# Altium schematic sheet 1_Mcu.SchDoc: MCU
size A3; SheetNumber: 1
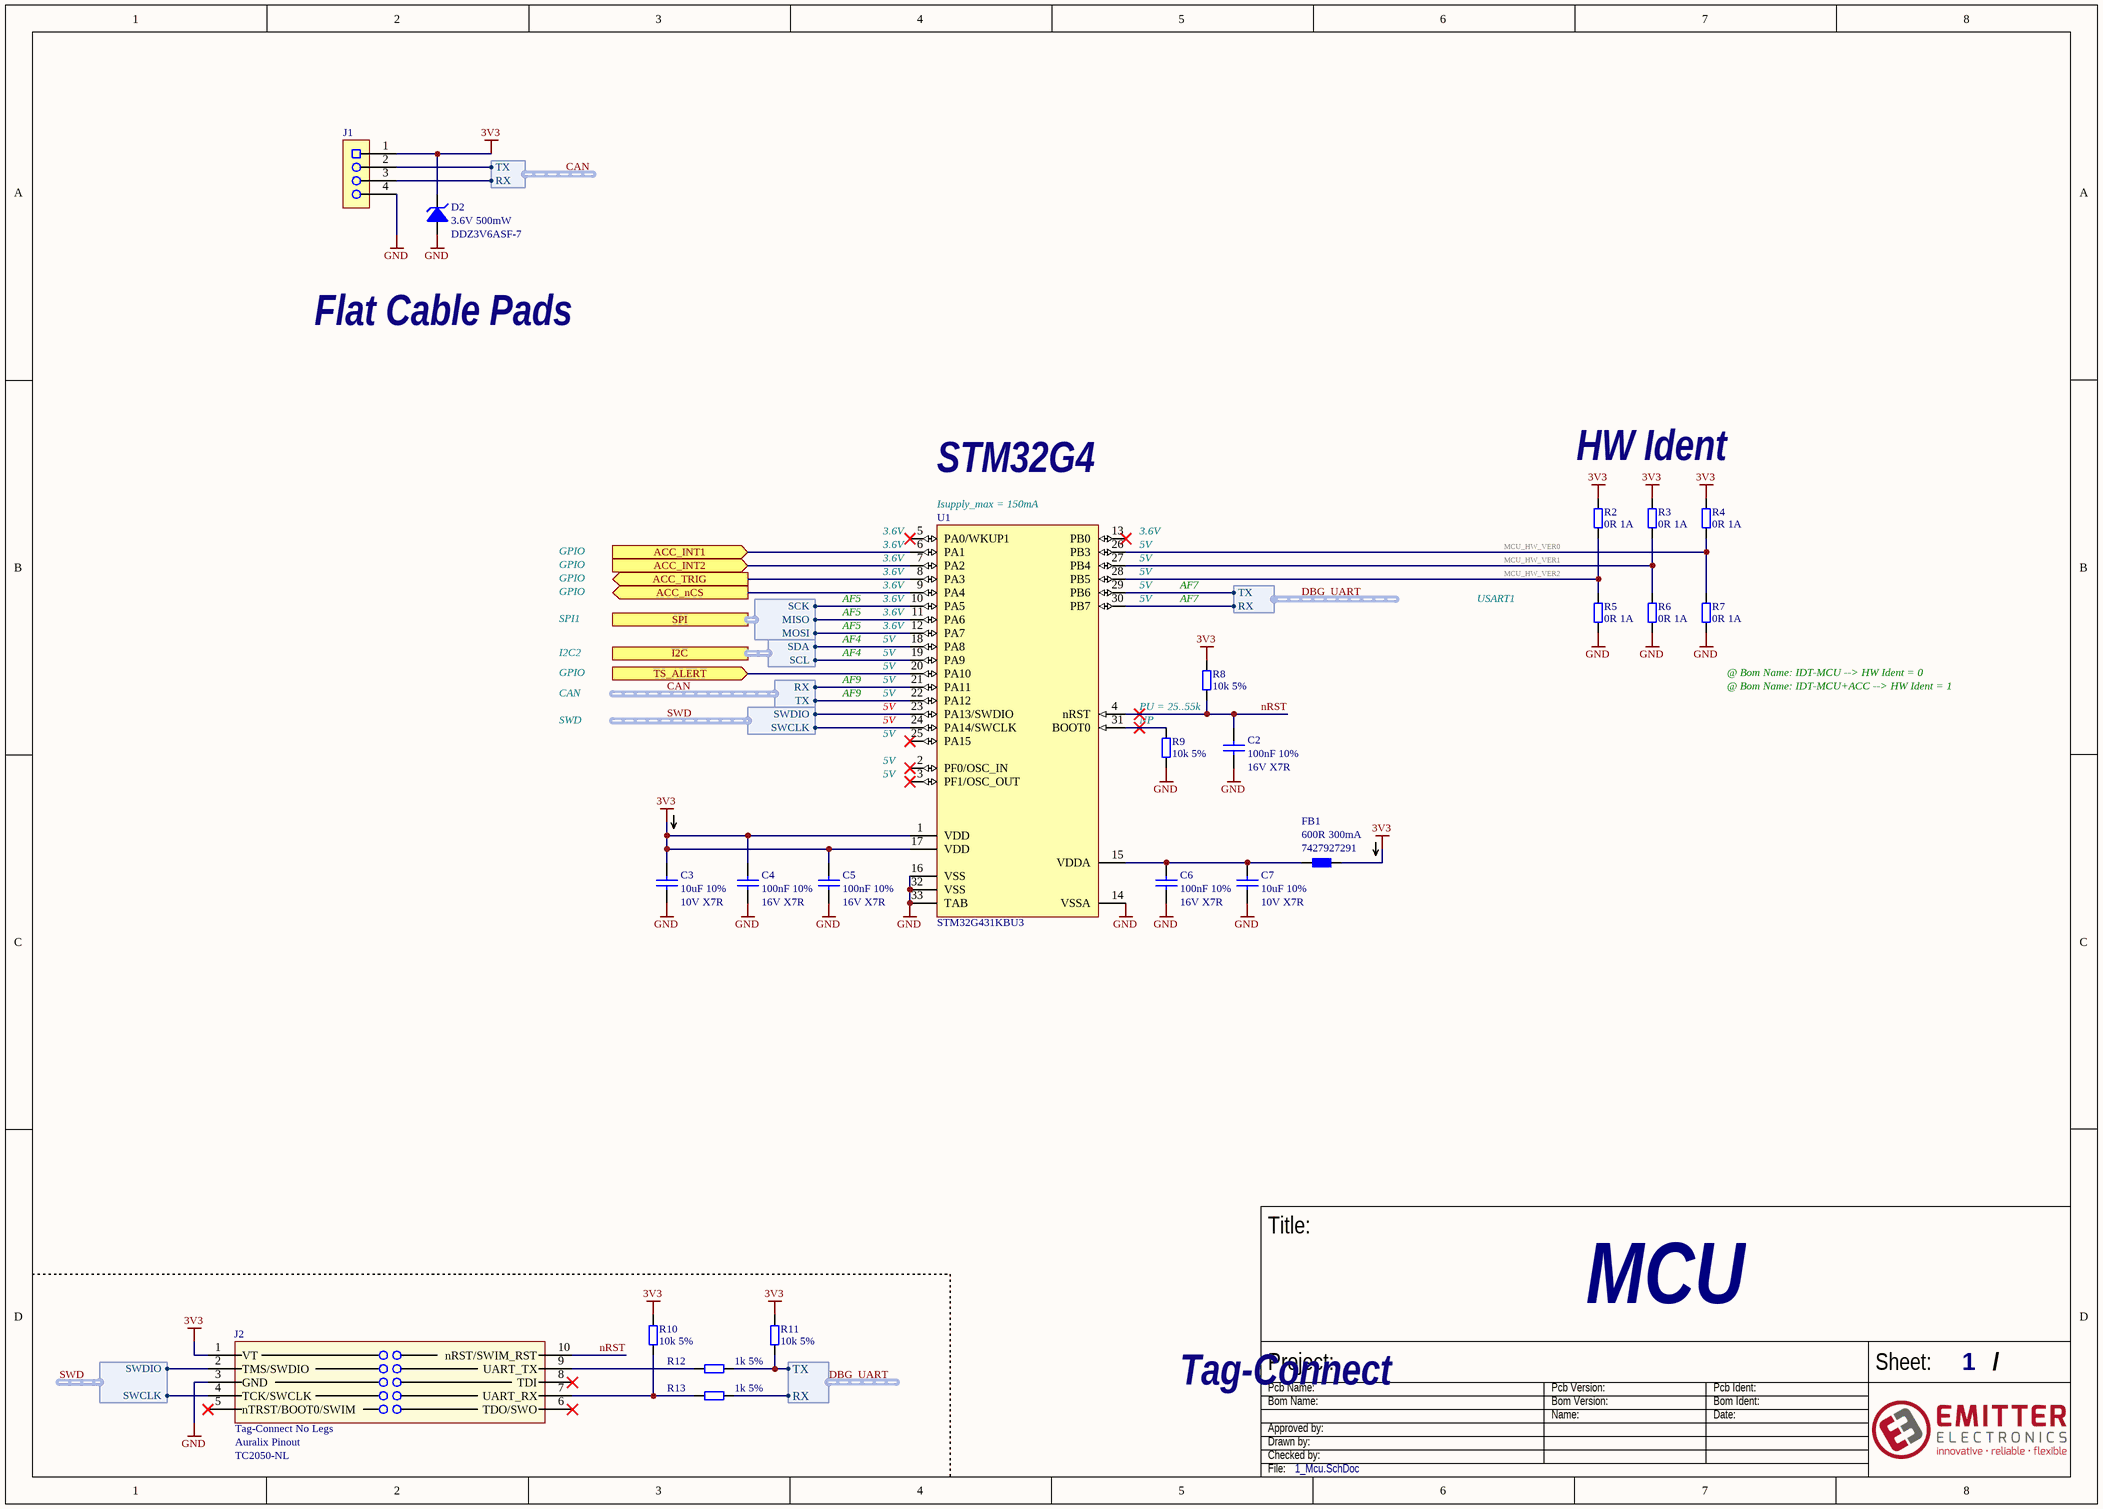
[diagram p0: 1_Mcu.SchDoc]

## Parts
C2  Param 2: 16V X7R  Param 1: 100nF 10%  [CAP_0402_L]  (hidden comment: CC0402KRX7R7BB104)
C3  Param 2: 10V X7R  Param 1: 10uF 10%  [CAP_0805_L]  (hidden comment: CC0805KKX7R6BB106)
C4  Param 2: 16V X7R  Param 1: 100nF 10%  [CAP_0402_L]  (hidden comment: CC0402KRX7R7BB104)
C5  Param 2: 16V X7R  Param 1: 100nF 10%  [CAP_0402_L]  (hidden comment: CC0402KRX7R7BB104)
C6  Param 2: 16V X7R  Param 1: 100nF 10%  [CAP_0402_L]  (hidden comment: CC0402KRX7R7BB104)
C7  Param 2: 10V X7R  Param 1: 10uF 10%  [CAP_0805_L]  (hidden comment: CC0805KKX7R6BB106)
D2  Param 1: 3.6V 500mW  [SOD170X130_SOD-323_SC-76]  (hidden comment: DDZ3V6ASF-7)
FB1  Param 1: 600R 300mA  [BEAD_0402_L]  (hidden comment: 7427927291)
J1  /  [CONN-FLAT_2.00MM_1X4_SMD_320X120]  (value not drawn)  (no BOM)
J2  Param 2: Auralix Pinout  Param 1: Tag-Connect No Legs  [CONN-TAG_CONNECT_TC2050-NL]  (hidden comment: TC2050-NL)  (no BOM)
R2  Param 1: 0R 1A  [RES_0402_JP_L]  (hidden comment: RC0402JR-070RL)
R3  Param 1: 0R 1A  [RES_0402_JP_L]  (hidden comment: RC0402JR-070RL)
R4  Param 1: 0R 1A  [RES_0402_JP_L]  (hidden comment: RC0402JR-070RL)
R5  Param 1: 0R 1A  [RES_0402_JP_L]  (hidden comment: RC0402JR-070RL)
R6  Param 1: 0R 1A  [RES_0402_JP_L]  (hidden comment: RC0402JR-070RL)
R7  Param 1: 0R 1A  [RES_0402_JP_L]  (hidden comment: RC0402JR-070RL)
R8  Param 1: 10k 5%  [RES_0402_L]  (hidden comment: RC0402JR-0710KL)
R9  Param 1: 10k 5%  [RES_0402_L]  (hidden comment: RC0402JR-0710KL)
R10  Param 1: 10k 5%  [RES_0402_L]  (hidden comment: RC0402JR-0710KL)
R11  Param 1: 10k 5%  [RES_0402_L]  (hidden comment: RC0402JR-0710KL)
R12  Param 1: 1k 5%  [RES_0402_L]  (hidden comment: RC0402JR-071KL)
R13  Param 1: 1k 5%  [RES_0402_L]  (hidden comment: RC0402JR-071KL)
U1  STM32G431KBU3  [QFN33P50_500X500T360X360]

## Ports
ACC_INT1 (in), ACC_INT2 (in), ACC_nCS (out), ACC_TRIG (out), I2C (harness I2C), SPI (harness SPI), TS_ALERT (in)

## Harnesses
CAN_: TX, RX
UART: TX, RX
SWD: SWCLK, SWDIO
SPI: SCK, MISO, MOSI
I2C: SDA, SCL
CAN_: RX, TX

## Nets
3V3: C3.1 C4.1 C5.1 D2.1 FB1.2 J1.1 J2.1(VT) R2.1 R3.1 R4.1 R8.1 R10.1 R11.1 U1.1(VDD) U1.17(VDD)
GND: C2.2 C3.2 C4.2 C5.2 C6.2 C7.2 D2.2 J1.4 J2.3(GND) R5.2 R6.2 R7.2 R9.2 U1.14(VSSA) U1.16(VSS) U1.32(VSS) U1.33(TAB)
ACC_INT1: U1.6(PA1) ; port ACC_INT1
ACC_INT2: U1.7(PA2) ; port ACC_INT2
ACC_nCS: U1.9(PA4) ; port ACC_nCS
ACC_TRIG: U1.8(PA3) ; port ACC_TRIG
CAN.RX: J1.3 U1.21(PA11) ; harness CAN_.RX
CAN.TX: J1.2 U1.22(PA12) ; harness CAN_.TX
DBG_UART.RX: R13.2 U1.30(PB7) ; harness UART.RX
DBG_UART.TX: R11.2 R12.2 U1.29(PB6) ; harness UART.TX
MCU_HW_VER0: R4.2 R7.1 U1.26(PB3)
MCU_HW_VER1: R3.2 R6.1 U1.27(PB4)
MCU_HW_VER2: R2.2 R5.1 U1.28(PB5)
nRST: C2.1 J2.10(nRST/SWIM_RST) R8.2 U1.4(nRST)
SWD.SWCLK: J2.4(TCK/SWCLK) U1.24(PA14/SWCLK) ; harness SWD.SWCLK
SWD.SWDIO: J2.2(TMS/SWDIO) U1.23(PA13/SWDIO) ; harness SWD.SWDIO
TS_ALERT: U1.20(PA10) ; port TS_ALERT
NetC6_1: C6.1 C7.1 FB1.1 U1.15(VDDA)
NetJ2_7: J2.7(UART_RX) R10.2 R13.1
NetJ2_9: J2.9(UART_TX) R12.1
NetR9_1: R9.1 U1.31(BOOT0)
NetU1_10: U1.10(PA5) ; port SPI.SCK
NetU1_11: U1.11(PA6) ; port SPI.MISO
NetU1_12: U1.12(PA7) ; port SPI.MOSI
NetU1_18: U1.18(PA8) ; port I2C.SDA
NetU1_19: U1.19(PA9) ; port I2C.SCL

Not connected (* = marked no-connect by the designer): J2 5(nTRST/BOOT0/SWIM)* 6(TDO/SWO)* 8(TDI)*; U1 2(PF0/OSC_IN)* 3(PF1/OSC_OUT)* 5(PA0/WKUP1)* 13(PB0)* 25(PA15)*

## Notes on the sheet
- Flat Cable Pads
- STM32G4
- HW Ident
- GPIO
- AF7
- SPI1
- AF4
- AF5
- USART1
- CAN
- SWD
- I2C2
- AF9
- @ Bom Name: IDT-MCU --> HW Ident = 0
- @ Bom Name: IDT-MCU+ACC --> HW Ident = 1
- Tag-Connect
- Title:
- Project:
- Pcb Name:
- Pcb Version:
- Pcb Ident:
- Sheet:
- /
- Bom Name:
- Drawn by:
- Checked by:
- Approved by:
- Bom Version:
- Name:
- Bom Ident:
- Date:
- File:
- (in symbol IC-MCU_STM32G431KBU3) Isupply_max = 150mA; 3.6V; 5V; PU = 25..55k; NP

## Library data of the parts
C2 C4-C6 = CAP_0402_100nF_10%_16V_X7R_CC0402KRX7R7BB104: CAP 0402 100nF 10% 16V X7R; Assembly Service Part Choice: Yes; zAlternative 1 - Mfr No 2: /; zAlternative 2 - Mfr No 1: C0402C104K4RACTU; zAlternative 1 - Mfr No 1: 0402YC104KAT2A; zAlternative 4 - Mfr No 1: GRM155R71C104JA88D; Mfr 1: YAGEO; zAlternative 1 - Mfr 1: AVX; zAlternative 2 - Mfr 1: KEMET; zAlternative 4 - Mfr 1: MURATA; Placement: SMD; Auralix WH: WH-ID-016; Temp Max: +125°C; Temp Min: -55°C; Author: GH; Date: 10.8.2020; Assembly Service Provides Material: Yes; sDigikey 1: /; sFarnell 1: /; sMouser 1: /; sDigikey 2: /; sFarnell 2: /; sMouser 2: /; Mfr No 1: CC0402KRX7R7BB104; Mfr No 2: /; zAlternative 2 - Mfr No 2: /; zAlternative 3 - Mfr No 2: /; zAlternative 3 - Mfr No 1: /; zAlternative 4 - Mfr No 2: /; zAlternative 5 - Mfr No 1: /; zAlternative 5 - Mfr No 2: /; zAlternative 6 - Mfr No 1: /; zAlternative 6 - Mfr No 2: /; zAlternative 7 - Mfr No 1: /; zAlternative 7 - Mfr No 2: /; zAlternative 8 - Mfr No 1: /; zAlternative 8 - Mfr No 2: /; zAlternative 9 - Mfr No 1: /; zAlternative 9 - Mfr No 2: /; Mfr 2: /; Mfr 3: /; Mfr No 3: /; sArrow 1: /; sArrow 2: /; sArrow 3: /; sDigikey 3: /; sFarnell 3: /; sMouser 3: /; zAlternative 1 - Mfr 2: /; zAlternative 2 - Mfr 2: /; zAlternative 3 - Mfr 1: /; zAlternative 3 - Mfr 2: /; zAlternative 4 - Mfr 2: /; zAlternative 5 - Mfr 1: /; zAlternative 5 - Mfr 2: /; zAlternative 6 - Mfr 1: /; zAlternative 6 - Mfr 2: /; zAlternative 7 - Mfr 1: /; zAlternative 7 - Mfr 2: /; zAlternative 8 - Mfr 1: /; zAlternative 8 - Mfr 2: /; zAlternative 9 - Mfr 1: /; zAlternative 9 - Mfr 2: /
C3 C7 = CAP_0805_10uF_10%_10V_X7R_CC0805KKX7R6BB106: CAP 0805 10uF 10% 10V X7R; Assembly Service Part Choice: Yes; zAlternative 1 - Mfr No 2: /; zAlternative 2 - Mfr No 1: C0805C106K8RACTU; zAlternative 1 - Mfr No 1: 0805ZC106KAT2A; Mfr 1: YAGEO; zAlternative 1 - Mfr 1: AVX; zAlternative 2 - Mfr 1: KEMET; Placement: SMD; Temp Max: +125°C; Temp Min: -55°C; Author: GH; Date: 10.8.2020; Assembly Service Provides Material: Yes; sDigikey 1: /; sFarnell 1: /; sMouser 1: /; sDigikey 2: /; sFarnell 2: /; sMouser 2: /; Mfr No 1: CC0805KKX7R6BB106; Mfr No 2: /; zAlternative 2 - Mfr No 2: /; zAlternative 3 - Mfr No 2: /; zAlternative 3 - Mfr No 1: /; zAlternative 4 - Mfr No 1: /; zAlternative 4 - Mfr No 2: /; zAlternative 5 - Mfr No 1: /; zAlternative 5 - Mfr No 2: /; zAlternative 6 - Mfr No 1: /; zAlternative 6 - Mfr No 2: /; zAlternative 7 - Mfr No 1: /; zAlternative 7 - Mfr No 2: /; zAlternative 8 - Mfr No 1: /; zAlternative 8 - Mfr No 2: /; zAlternative 9 - Mfr No 1: /; zAlternative 9 - Mfr No 2: /; Auralix WH: /; Mfr 2: /; Mfr 3: /; Mfr No 3: /; sArrow 1: /; sArrow 2: /; sArrow 3: /; sDigikey 3: /; sFarnell 3: /; sMouser 3: /; zAlternative 1 - Mfr 2: /; zAlternative 2 - Mfr 2: /; zAlternative 3 - Mfr 1: /; zAlternative 3 - Mfr 2: /; zAlternative 4 - Mfr 1: /; zAlternative 4 - Mfr 2: /; zAlternative 5 - Mfr 1: /; zAlternative 5 - Mfr 2: /; zAlternative 6 - Mfr 1: /; zAlternative 6 - Mfr 2: /; zAlternative 7 - Mfr 1: /; zAlternative 7 - Mfr 2: /; zAlternative 8 - Mfr 1: /; zAlternative 8 - Mfr 2: /; zAlternative 9 - Mfr 1: /; zAlternative 9 - Mfr 2: /
D2 = D-Z_3.6V_500mW_DDZ3V6ASF-7: DDZ3V6ASF-7 - Zener Diodes 500mW 3.57V Zener 500mW 0.9V Vf SOD-323F-2; Assembly Service Part Choice: No; zAlternative 1 - Mfr No 1: DDZ3V6BSF-7; Placement: SMD; Assembly Service Provides Material: Yes; Param 2: /; Temp min: -65°C; Temp max: +150°C; Author: GH; Date: 16.03.2021; sDigikey 1: Yes; sFarnell 1: No; sMouser 1: Yes; sDigikey 2: /; sFarnell 2: /; sMouser 2: /; Mfr No 2: /; zAlternative 1 - Mfr No 2: /; zAlternative 2 - Mfr No 1: /; zAlternative 2 - Mfr No 2: /; zAlternative 3 - Mfr No 1: /; zAlternative 3 - Mfr No 2: /; zAlternative 4 - Mfr No 1: /; zAlternative 4 - Mfr No 2: /; zAlternative 5 - Mfr No 1: /; zAlternative 5 - Mfr No 2: /; zAlternative 6 - Mfr No 1: /; zAlternative 6 - Mfr No 2: /; zAlternative 7 - Mfr No 1: /; zAlternative 7 - Mfr No 2: /; zAlternative 8 - Mfr No 1: /; zAlternative 8 - Mfr No 2: /; zAlternative 9 - Mfr No 1: /; zAlternative 9 - Mfr No 2: /; Mfr No 1: DDZ3V6ASF-7; Auralix WH: /; Mfr 1: DIODES; Mfr 2: /; Mfr 3: /; Mfr No 3: /; sArrow 1: Yes; sArrow 2: /; sArrow 3: /; sDigikey 3: /; sFarnell 3: /; sMouser 3: /; zAlternative 1 - Mfr 1: DIODES; zAlternative 1 - Mfr 2: /; zAlternative 2 - Mfr 1: /; zAlternative 2 - Mfr 2: /; zAlternative 3 - Mfr 1: /; zAlternative 3 - Mfr 2: /; zAlternative 4 - Mfr 1: /; zAlternative 4 - Mfr 2: /; zAlternative 5 - Mfr 1: /; zAlternative 5 - Mfr 2: /; zAlternative 6 - Mfr 1: /; zAlternative 6 - Mfr 2: /; zAlternative 7 - Mfr 1: /; zAlternative 7 - Mfr 2: /; zAlternative 8 - Mfr 1: /; zAlternative 8 - Mfr 2: /; zAlternative 9 - Mfr 1: /; zAlternative 9 - Mfr 2: /
FB1 = BEAD_0402_600R_300mA_7427927291: 7427927291 - Ferrite Bead, 0402 [1005 Metric], 600 ohm, 300 mA, WE-CBF Series, 0.6 ohm, ± 25%; Assembly Service Part Choice: No; Mfr 1: WURTH ELECTRONICS; Placement: SMD; Assembly Service Provides Material: Yes; Param 2: /; Temp Max: +125°C; Temp Min: -55°C; Author: TV; Date: 10.7.2018; sDigikey 1: Yes; sMouser 1: Yes; sFarnell 1: Yes; sDigikey 2: /; sFarnell 2: /; sMouser 2: /; Mfr No 2: /; zAlternative 1 - Mfr No 2: /; zAlternative 2 - Mfr No 1: /; zAlternative 1 - Mfr No 1: /; zAlternative 2 - Mfr No 2: /; zAlternative 3 - Mfr No 1: /; zAlternative 3 - Mfr No 2: /; zAlternative 4 - Mfr No 1: /; zAlternative 4 - Mfr No 2: /; zAlternative 5 - Mfr No 1: /; zAlternative 5 - Mfr No 2: /; zAlternative 6 - Mfr No 1: /; zAlternative 6 - Mfr No 2: /; zAlternative 7 - Mfr No 1: /; zAlternative 7 - Mfr No 2: /; zAlternative 8 - Mfr No 1: /; zAlternative 8 - Mfr No 2: /; zAlternative 9 - Mfr No 1: /; zAlternative 9 - Mfr No 2: /; Mfr No 1: 7427927291; Auralix WH: /; Mfr 2: /; Mfr 3: /; Mfr No 3: /; sArrow 1: /; sArrow 2: /; sArrow 3: /; sDigikey 3: /; sFarnell 3: /; sMouser 3: /; zAlternative 1 - Mfr 1: /; zAlternative 1 - Mfr 2: /; zAlternative 2 - Mfr 1: /; zAlternative 2 - Mfr 2: /; zAlternative 3 - Mfr 1: /; zAlternative 3 - Mfr 2: /; zAlternative 4 - Mfr 1: /; zAlternative 4 - Mfr 2: /; zAlternative 5 - Mfr 1: /; zAlternative 5 - Mfr 2: /; zAlternative 6 - Mfr 1: /; zAlternative 6 - Mfr 2: /; zAlternative 7 - Mfr 1: /; zAlternative 7 - Mfr 2: /; zAlternative 8 - Mfr 1: /; zAlternative 8 - Mfr 2: /; zAlternative 9 - Mfr 1: /; zAlternative 9 - Mfr 2: /
J1 = CONN-FLAT_2.00MM_1X4_SMD_320X120: Solder connection 4 pads SMD round flat; Placement: SMD; Assembly Service Part Choice: /; Temp max: /; Temp min: /; Author: GH; Date: 17.03.2021; sFarnell 1: /; sMouser 1: /; sDigikey 1: /; Assembly Service Provides Material: /; sDigikey 2: /; sFarnell 2: /; sMouser 2: /; Mfr No 2: /; Mfr No 1: /; zAlternative 1 - Mfr No 2: /; zAlternative 2 - Mfr No 1: /; zAlternative 1 - Mfr No 1: /; zAlternative 2 - Mfr No 2: /; zAlternative 3 - Mfr No 1: /; zAlternative 3 - Mfr No 2: /; zAlternative 4 - Mfr No 1: /; zAlternative 4 - Mfr No 2: /; zAlternative 5 - Mfr No 1: /; zAlternative 5 - Mfr No 2: /; zAlternative 6 - Mfr No 1: /; zAlternative 6 - Mfr No 2: /; zAlternative 7 - Mfr No 1: /; zAlternative 7 - Mfr No 2: /; zAlternative 8 - Mfr No 1: /; zAlternative 8 - Mfr No 2: /; zAlternative 9 - Mfr No 1: /; zAlternative 9 - Mfr No 2: /; Auralix WH: /; Param 1: /; Param 2: /; Mfr 1: /; Mfr 2: /; Mfr 3: /; Mfr No 3: /; sArrow 1: /; sArrow 2: /; sArrow 3: /; sDigikey 3: /; sFarnell 3: /; sMouser 3: /; zAlternative 1 - Mfr 1: /; zAlternative 1 - Mfr 2: /; zAlternative 2 - Mfr 1: /; zAlternative 2 - Mfr 2: /; zAlternative 3 - Mfr 1: /; zAlternative 3 - Mfr 2: /; zAlternative 4 - Mfr 1: /; zAlternative 4 - Mfr 2: /; zAlternative 5 - Mfr 1: /; zAlternative 5 - Mfr 2: /; zAlternative 6 - Mfr 1: /; zAlternative 6 - Mfr 2: /; zAlternative 7 - Mfr 1: /; zAlternative 7 - Mfr 2: /; zAlternative 8 - Mfr 1: /; zAlternative 8 - Mfr 2: /; zAlternative 9 - Mfr 1: /; zAlternative 9 - Mfr 2: /
J2 = CONN-TAG_CONNECT_TC2050-NL_AURALIX: TC2050-NL - Tag Connect 10 Pin - No Legs - Auralix Pinout; Placement: /; Assembly Service Part Choice: /; Temp Max: /; Temp Min: /; Assembly Service Provides Material: /; Author: TV; Date: 23.7.2018; sFarnell 1: /; sMouser 1: /; sDigikey 1: /; sDigikey 2: /; sFarnell 2: /; sMouser 2: /; Mfr No 2: /; Mfr No 1: TC2050-NL; zAlternative 1 - Mfr No 2: /; zAlternative 2 - Mfr No 1: /; zAlternative 1 - Mfr No 1: /; zAlternative 2 - Mfr No 2: /; zAlternative 3 - Mfr No 1: /; zAlternative 3 - Mfr No 2: /; zAlternative 4 - Mfr No 1: /; zAlternative 4 - Mfr No 2: /; zAlternative 5 - Mfr No 1: /; zAlternative 5 - Mfr No 2: /; zAlternative 6 - Mfr No 1: /; zAlternative 6 - Mfr No 2: /; zAlternative 7 - Mfr No 1: /; zAlternative 7 - Mfr No 2: /; zAlternative 8 - Mfr No 1: /; zAlternative 8 - Mfr No 2: /; zAlternative 9 - Mfr No 1: /; zAlternative 9 - Mfr No 2: /; Auralix WH: /; Mfr 1: TAG CONNECT; Mfr 2: /; Mfr 3: /; Mfr No 3: /; sArrow 1: /; sArrow 2: /; sArrow 3: /; sDigikey 3: /; sFarnell 3: /; sMouser 3: /; zAlternative 1 - Mfr 1: /; zAlternative 1 - Mfr 2: /; zAlternative 2 - Mfr 1: /; zAlternative 2 - Mfr 2: /; zAlternative 3 - Mfr 1: /; zAlternative 3 - Mfr 2: /; zAlternative 4 - Mfr 1: /; zAlternative 4 - Mfr 2: /; zAlternative 5 - Mfr 1: /; zAlternative 5 - Mfr 2: /; zAlternative 6 - Mfr 1: /; zAlternative 6 - Mfr 2: /; zAlternative 7 - Mfr 1: /; zAlternative 7 - Mfr 2: /; zAlternative 8 - Mfr 1: /; zAlternative 8 - Mfr 2: /; zAlternative 9 - Mfr 1: /; zAlternative 9 - Mfr 2: /
R2-R7 = RES_0402_0R_5%_1A_RC0402JR-070RL: RES 0402 0R 5% 1A 63mW 50V; Assembly Service Part Choice: Yes; zAlternative 1 - Mfr No 2: RC0402FR-130RL; zAlternative 2 - Mfr No 1: AC0402JR-070RL; zAlternative 1 - Mfr No 1: RC0402FR-070RL; zAlternative 2 - Mfr No 2: AC0402JR-130RL; zAlternative 3 - Mfr No 2: AC0402FR-130RL; zAlternative 3 - Mfr No 1: AC0402FR-070RL; zAlternative 4 - Mfr No 1: /; Mfr 1: YAGEO; Placement: SMD; Param 2: 5% 63mW 50V; Temp Max: +155°C; Temp Min: -55°C; Author: GH; Date: 10.8.2020; Assembly Service Provides Material: Yes; sDigikey 1: /; sFarnell 1: /; sMouser 1: /; sDigikey 2: /; sFarnell 2: /; sMouser 2: /; Mfr No 1: RC0402JR-070RL; Mfr No 2: RC0402JR-130RL; zAlternative 4 - Mfr No 2: /; zAlternative 5 - Mfr No 1: /; zAlternative 5 - Mfr No 2: /; zAlternative 6 - Mfr No 1: /; zAlternative 6 - Mfr No 2: /; zAlternative 7 - Mfr No 1: /; zAlternative 7 - Mfr No 2: /; zAlternative 8 - Mfr No 1: /; zAlternative 8 - Mfr No 2: /; zAlternative 9 - Mfr No 1: /; zAlternative 9 - Mfr No 2: /; Auralix WH: /; Mfr 2: YAGEO; Mfr 3: /; Mfr No 3: /; sArrow 1: /; sArrow 2: /; sArrow 3: /; sDigikey 3: /; sFarnell 3: /; sMouser 3: /; zAlternative 1 - Mfr 1: YAGEO; zAlternative 1 - Mfr 2: YAGEO; zAlternative 2 - Mfr 1: YAGEO; zAlternative 2 - Mfr 2: YAGEO; zAlternative 3 - Mfr 1: YAGEO; zAlternative 3 - Mfr 2: YAGEO; zAlternative 4 - Mfr 1: /; zAlternative 4 - Mfr 2: /; zAlternative 5 - Mfr 1: /; zAlternative 5 - Mfr 2: /; zAlternative 6 - Mfr 1: /; zAlternative 6 - Mfr 2: /; zAlternative 7 - Mfr 1: /; zAlternative 7 - Mfr 2: /; zAlternative 8 - Mfr 1: /; zAlternative 8 - Mfr 2: /; zAlternative 9 - Mfr 1: /; zAlternative 9 - Mfr 2: /
R8-R11 = RES_0402_10k_5%_RC0402JR-0710KL: RES 0402 10k 5% 63mW 50V; Assembly Service Part Choice: Yes; zAlternative 1 - Mfr No 2: RC0402FR-1310KL; zAlternative 2 - Mfr No 1: AC0402JR-0710KL; zAlternative 1 - Mfr No 1: RC0402FR-0710KL; zAlternative 2 - Mfr No 2: AC0402JR-1310KL; zAlternative 3 - Mfr No 2: AC0402FR-1310KL; zAlternative 3 - Mfr No 1: AC0402FR-0710KL; zAlternative 4 - Mfr No 1: /; Mfr 1: YAGEO; Placement: SMD; Temp Max: +155°C; Temp Min: -55°C; Author: GH; Date: 10.8.2020; Assembly Service Provides Material: Yes; sDigikey 1: /; sFarnell 1: /; sMouser 1: /; sDigikey 2: /; sFarnell 2: /; sMouser 2: /; Mfr No 1: RC0402JR-0710KL; Mfr No 2: RC0402JR-1310KL; zAlternative 4 - Mfr No 2: /; zAlternative 5 - Mfr No 1: /; zAlternative 5 - Mfr No 2: /; zAlternative 6 - Mfr No 1: /; zAlternative 6 - Mfr No 2: /; zAlternative 7 - Mfr No 1: /; zAlternative 7 - Mfr No 2: /; zAlternative 8 - Mfr No 1: /; zAlternative 8 - Mfr No 2: /; zAlternative 9 - Mfr No 1: /; zAlternative 9 - Mfr No 2: /; Param 2: 63mW 50V; Auralix WH: /; Mfr 2: YAGEO; Mfr 3: /; Mfr No 3: /; sArrow 1: /; sArrow 2: /; sArrow 3: /; sDigikey 3: /; sFarnell 3: /; sMouser 3: /; zAlternative 1 - Mfr 1: YAGEO; zAlternative 1 - Mfr 2: YAGEO; zAlternative 2 - Mfr 1: YAGEO; zAlternative 2 - Mfr 2: YAGEO; zAlternative 3 - Mfr 1: YAGEO; zAlternative 3 - Mfr 2: YAGEO; zAlternative 4 - Mfr 1: /; zAlternative 4 - Mfr 2: /; zAlternative 5 - Mfr 1: /; zAlternative 5 - Mfr 2: /; zAlternative 6 - Mfr 1: /; zAlternative 6 - Mfr 2: /; zAlternative 7 - Mfr 1: /; zAlternative 7 - Mfr 2: /; zAlternative 8 - Mfr 1: /; zAlternative 8 - Mfr 2: /; zAlternative 9 - Mfr 1: /; zAlternative 9 - Mfr 2: /
R12 R13 = RES_0402_1k_5%_RC0402JR-071KL: RES 0402 1k 5% 63mW 50V; Assembly Service Part Choice: Yes; zAlternative 1 - Mfr No 2: RC0402FR-131KL; zAlternative 2 - Mfr No 1: AC0402JR-071KL; zAlternative 1 - Mfr No 1: RC0402FR-071KL; zAlternative 2 - Mfr No 2: AC0402JR-131KL; zAlternative 3 - Mfr No 2: AC0402FR-131KL; zAlternative 3 - Mfr No 1: AC0402FR-071KL; zAlternative 4 - Mfr No 1: /; Mfr 1: YAGEO; Placement: SMD; Temp Max: +155°C; Temp Min: -55°C; Assembly Service Provides Material: Yes; Author: GH; Date: 10.8.2020; sDigikey 1: /; sFarnell 1: /; sMouser 1: /; sDigikey 2: /; sFarnell 2: /; sMouser 2: /; Param 2: 63mW 50V; Mfr No 1: RC0402JR-071KL; Mfr No 2: RC0402JR-131KL; zAlternative 4 - Mfr No 2: /; zAlternative 5 - Mfr No 1: /; zAlternative 5 - Mfr No 2: /; zAlternative 6 - Mfr No 1: /; zAlternative 6 - Mfr No 2: /; zAlternative 7 - Mfr No 1: /; zAlternative 7 - Mfr No 2: /; zAlternative 8 - Mfr No 1: /; zAlternative 8 - Mfr No 2: /; zAlternative 9 - Mfr No 1: /; zAlternative 9 - Mfr No 2: /; Auralix WH: /; Mfr 2: YAGEO; Mfr 3: /; Mfr No 3: /; sArrow 1: /; sArrow 2: /; sArrow 3: /; sDigikey 3: /; sFarnell 3: /; sMouser 3: /; zAlternative 1 - Mfr 1: YAGEO; zAlternative 1 - Mfr 2: YAGEO; zAlternative 2 - Mfr 1: YAGEO; zAlternative 2 - Mfr 2: YAGEO; zAlternative 3 - Mfr 1: YAGEO; zAlternative 3 - Mfr 2: YAGEO; zAlternative 4 - Mfr 1: /; zAlternative 4 - Mfr 2: /; zAlternative 5 - Mfr 1: /; zAlternative 5 - Mfr 2: /; zAlternative 6 - Mfr 1: /; zAlternative 6 - Mfr 2: /; zAlternative 7 - Mfr 1: /; zAlternative 7 - Mfr 2: /; zAlternative 8 - Mfr 1: /; zAlternative 8 - Mfr 2: /; zAlternative 9 - Mfr 1: /; zAlternative 9 - Mfr 2: /
U1 = IC-MCU_STM32G431KBU3: STM32G431KBU3 - ARM MCU, STM32 Family STM32G4 Series Microcontrollers, ARM Cortex-M4F, 32bit, 170 MHz, 128 KB; Assembly Service Part Choice: No; Mfr 1: STMICROELECTRONICS; Placement: SMD; Assembly Service Provides Material: Yes; Param 1: /; Temp max: +125°C; Temp min: -40°C; Author: GH; Date: 20.11.2020; sDigikey 1: Yes; sFarnell 1: Yes; sMouser 1: Yes; sDigikey 2: /; sFarnell 2: /; sMouser 2: /; Param 2: /; Mfr No 2: /; zAlternative 1 - Mfr No 2: /; zAlternative 2 - Mfr No 1: /; zAlternative 1 - Mfr No 1: /; zAlternative 2 - Mfr No 2: /; zAlternative 3 - Mfr No 1: /; zAlternative 3 - Mfr No 2: /; zAlternative 4 - Mfr No 1: /; zAlternative 4 - Mfr No 2: /; zAlternative 5 - Mfr No 1: /; zAlternative 5 - Mfr No 2: /; zAlternative 6 - Mfr No 1: /; zAlternative 6 - Mfr No 2: /; zAlternative 7 - Mfr No 1: /; zAlternative 7 - Mfr No 2: /; zAlternative 8 - Mfr No 1: /; zAlternative 8 - Mfr No 2: /; zAlternative 9 - Mfr No 1: /; zAlternative 9 - Mfr No 2: /; Auralix WH: /; Mfr No 1: STM32G431KBU3; Mfr 2: /; Mfr 3: /; Mfr No 3: /; sArrow 1: /; sArrow 2: /; sArrow 3: /; sDigikey 3: /; sFarnell 3: /; sMouser 3: /; zAlternative 1 - Mfr 1: /; zAlternative 1 - Mfr 2: /; zAlternative 2 - Mfr 1: /; zAlternative 2 - Mfr 2: /; zAlternative 3 - Mfr 1: /; zAlternative 3 - Mfr 2: /; zAlternative 4 - Mfr 1: /; zAlternative 4 - Mfr 2: /; zAlternative 5 - Mfr 1: /; zAlternative 5 - Mfr 2: /; zAlternative 6 - Mfr 1: /; zAlternative 6 - Mfr 2: /; zAlternative 7 - Mfr 1: /; zAlternative 7 - Mfr 2: /; zAlternative 8 - Mfr 1: /; zAlternative 8 - Mfr 2: /; zAlternative 9 - Mfr 1: /; zAlternative 9 - Mfr 2: /